# EAGLE design Ecu (1) (EAGLE 9.1.3)
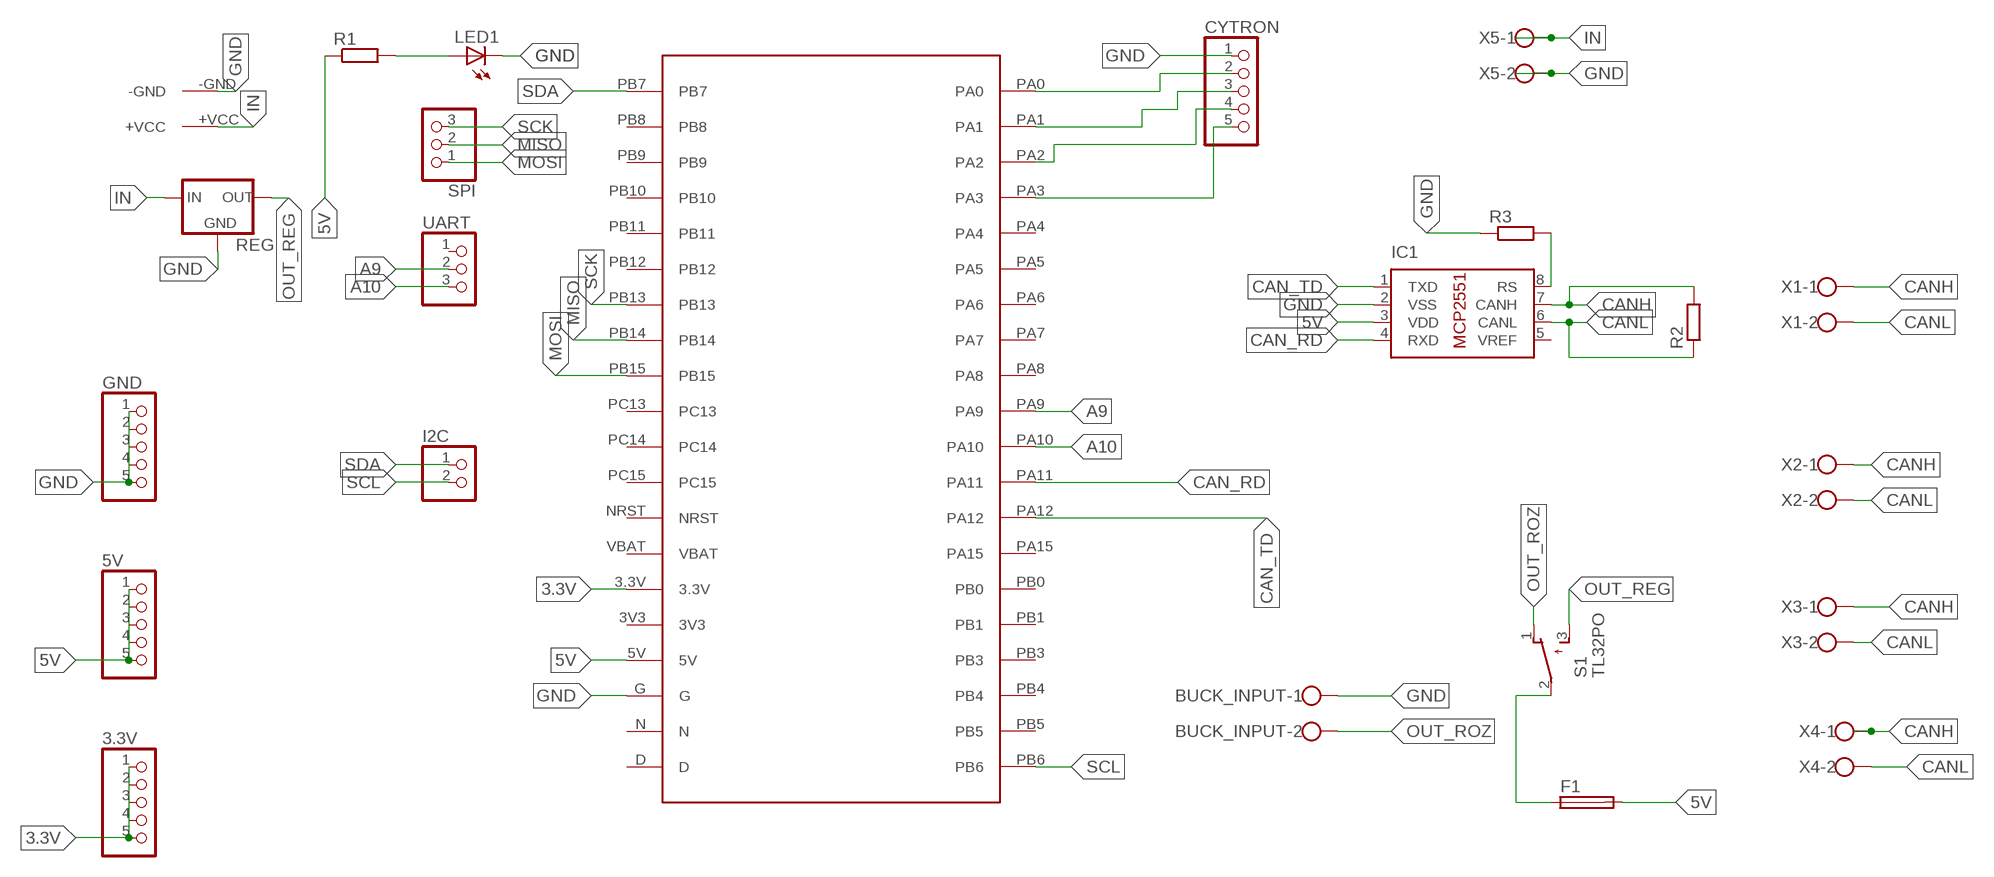
[diagram p0: schematic, sheet 1]

## Parts
3.3V  PINHD-1X5  [1X05]
5V  PINHD-1X5  [1X05]
BUCK_INPUT  W237-102  [W237-102]
CYTRON  PINHD-1X5  [1X05]
F1  GSH15  [GSH15]
GND  PINHD-1X5  [1X05]
I2C  PINHD-1X2  [1X02]
IC1  MCP2551/P  [DIL08]
LED1  LED5MM  [LED5MM]
MM1  XT60  [XT60]
R1  R-EU_0207/10  [0207/10]
R2  R-EU_0207/10  [0207/10]
R3  R-EU_0207/10  [0207/10]
REG  78XXS  [78XXS]
S1  TL32PO  [TL3XPO]
SPI  PINHD-1X3  [1X03]
U$3  STM32F103C8  [DIP]
UART  PINHD-1X3  [1X03]
X1  W237-102  [W237-102]
X2  W237-102  [W237-102]
X3  W237-102  [W237-102]
X4  W237-102  [W237-102]
X5  W237-102  [W237-102]

## Nets
3.3V: 3.3V.1 3.3V.5 U$3.3.3V
5V: 5V.1 5V.5 F1.2 IC1.3(VDD) R1.1 U$3.5V
A9: U$3.PA9 UART.2
A10: U$3.PA10 UART.3
CAN_RD: IC1.4(RXD) U$3.PA11
CAN_TD: IC1.1(TXD) U$3.PA12
CANH: IC1.7(CANH) R2.2 X1.1 X2.1 X3.1 X4.1
CANL: IC1.6(CANL) R2.1 X1.2 X2.2 X3.2 X4.2
GND: BUCK_INPUT.1 CYTRON.1 GND.1 GND.5 IC1.2(VSS) LED1.K(C) MM1.-GND R3.1 REG.GND U$3.G X5.2
IN: MM1.+VCC REG.IN X5.1
MISO: SPI.2 U$3.PB14
MOSI: SPI.1 U$3.PB15
N$1: LED1.A R1.2
N$3: CYTRON.2 U$3.PA0
N$4: CYTRON.4 U$3.PA2
N$5: CYTRON.3 U$3.PA1
N$6: CYTRON.5 U$3.PA3
N$8: IC1.8(RS) R3.2
N$9: F1.1 S1.2(P)
OUT_REG: REG.OUT S1.3(S)
OUT_ROZ: BUCK_INPUT.2 S1.1(O)
SCK: SPI.3 U$3.PB13
SCL: I2C.2 U$3.PB6
SDA: I2C.1 U$3.PB7
Unconnected: 3.3V.2 3.3V.3 3.3V.4 5V.2 5V.3 5V.4 GND.2 GND.3 GND.4 IC1.5(VREF) U$3.3V3 U$3.D U$3.N U$3.NRST U$3.PA4 U$3.PA5 U$3.PA6 U$3.PA7 U$3.PA8 U$3.PA15 U$3.PB0 U$3.PB1 U$3.PB3 U$3.PB4 U$3.PB5 U$3.PB8 U$3.PB9 U$3.PB10 U$3.PB11 U$3.PB12 U$3.PC13 U$3.PC14 U$3.PC15 U$3.VBAT UART.1

## Library data of the parts
3.3V 5V CYTRON GND = pinhead:PINHD-1X5: PIN HEADER
BUCK_INPUT X1-X5 = con-wago-500:W237-102: WAGO SCREW CLAMP; MPN: 237-102; OC_FARNELL: unknown; OC_NEWARK: 70K9898
F1 = fuse:GSH15: FUSE HOLDER grid 15mm, 19649 Wickmann; MPN: 64900001039; OC_FARNELL: 1271673; OC_NEWARK: 02P0318
I2C = pinhead:PINHD-1X2: PIN HEADER
IC1 = microchip-dspic:MCP2551: High-Speed CAN Transceiver
LED1 = led:LED: LED OSRAM: - CHIPLED LG R971, LG N971, LY N971, LG Q971, LY Q971, LO R971, LY R971 LH N974, LH R974 LS Q976, LO Q976, LY Q976 LO Q996 - Hyper CHIPLED LW Q18S LB Q993, LB Q99A, LB R99A - SideLED LS A670, LO A670, LY A670, LG A670, LP A670 LB A673, LV A673, LT A673, LW A673 LH A674 LY A675 LS A676, LA A676, LO A676, LY A676, LW A676 LS A679, LY A679, LG A679 - Hyper Micro SIDELED® LS Y876, LA Y876, LO Y876, LY Y876 LT Y87S - SmartLED LW L88C, LW L88S LB L89C, LB L89S, LG L890 LS L89K, LO L89K, LY L89K LS L896, LA L896, LO L896, LY L896 - TOPLED LS T670, LO T670, LY T670, LG T670, LP T670 LSG T670, LSP T670, LSY T670, LOP T670, LYG T670 LG T671, LOG T671, LSG T671 LB T673, LV T673, LT T673, LW T673 LH T674 LS T676, LA T676, LO T676, LY T676, LB T676, LH T676, LSB T676, LW T676 LB T67C, LV T67C, LT T67C, LS T67K, LO T67K, LY T67K, LW E67C LS E67B, LA E67B, LO E67B, LY E67B, LB E67C, LV E67C, LT E67C LW T67C LS T679, LY T679, LG T679 LS T770, LO T770, LY T770, LG T770, LP T770 LB T773, LV T773, LT T773, LW T773 LH T774 LS E675, LA E675, LY E675, LS T675 LS T776, LA T776, LO T776, LY T776, LB T776 LHGB T686 LT T68C, LB T68C - Hyper Mini TOPLED® LB M676 - Mini TOPLED Santana® LG M470 LS M47K, LO M47K, LY M47K Source: http://www.osram.convergy.de LUXEON: - LUMILED® LXK2-PW12-R00, LXK2-PW12-S00, LXK2-PW14-U00, LXK2-PW14-V00 LXK2-PM12-R00, LXK2-PM12-S00, LXK2-PM14-U00 LXK2-PE12-Q00, LXK2-PE12-R00, LXK2-PE12-S00, LXK2-PE14-T00, LXK2-PE14-U00 LXK2-PB12-K00, LXK2-PB12-L00, LXK2-PB12-M00, LXK2-PB14-N00, LXK2-PB14-P00, LXK2-PB14-Q00 LXK2-PR12-L00, LXK2-PR12-M00, LXK2-PR14-Q00, LXK2-PR14-R00 LXK2-PD12-Q00, LXK2-PD12-R00, LXK2-PD12-S00 LXK2-PH12-R00, LXK2-PH12-S00 LXK2-PL12-P00, LXK2-PL12-Q00, LXK2-PL12-R00 Source: www.luxeon.com KINGBRIGHT: KA-3528ASYC Source: www.kingbright.com
MM1 = torpedo:XT60
R1-R3 = rcl:R-EU_: RESISTOR, European symbol
REG = v-reg:78XXS: VOLTAGE REGULATOR
S1 = switch:TL32PO: TINY SWITCH ON - MOM Source: http://www2.produktinfo.conrad.com/datenblaetter/700000-724999/705152-da-01-de-Subminiaturschalter_TL_36YO.pdf
SPI UART = pinhead:PINHD-1X3: PIN HEADER
U$3 = stm_developer_board:STM32F103C8: STM32F103C8 Block

## Board
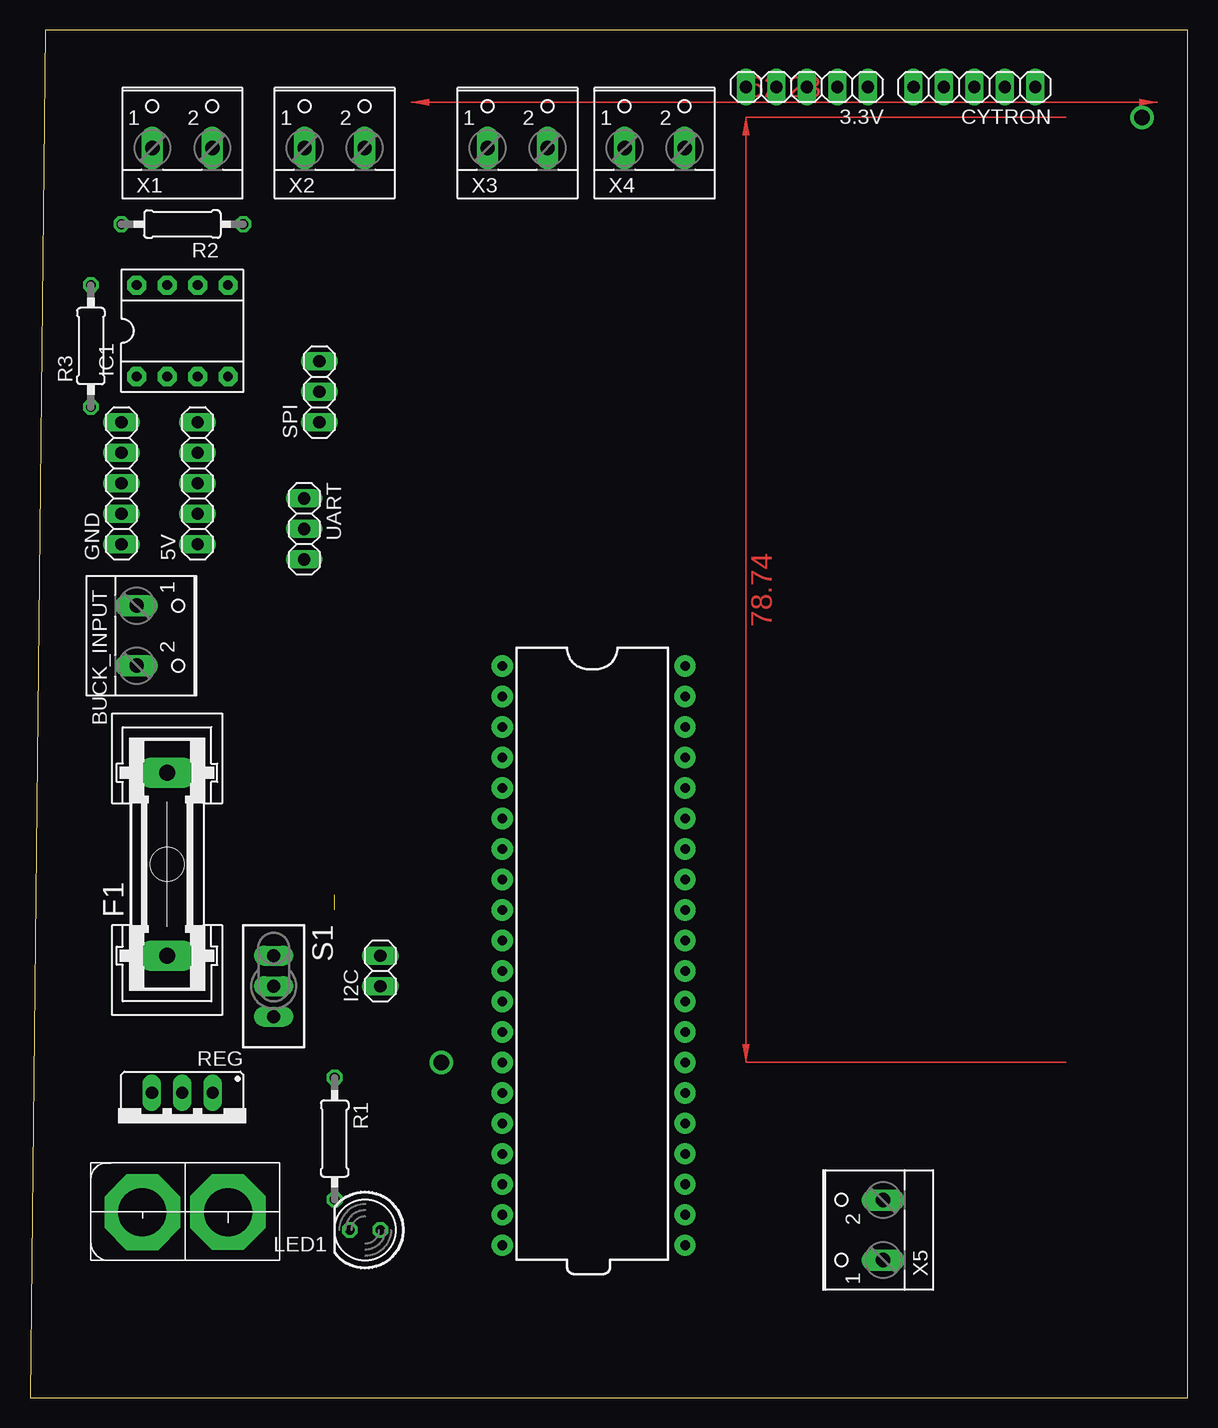
[diagram p1: board, top side]
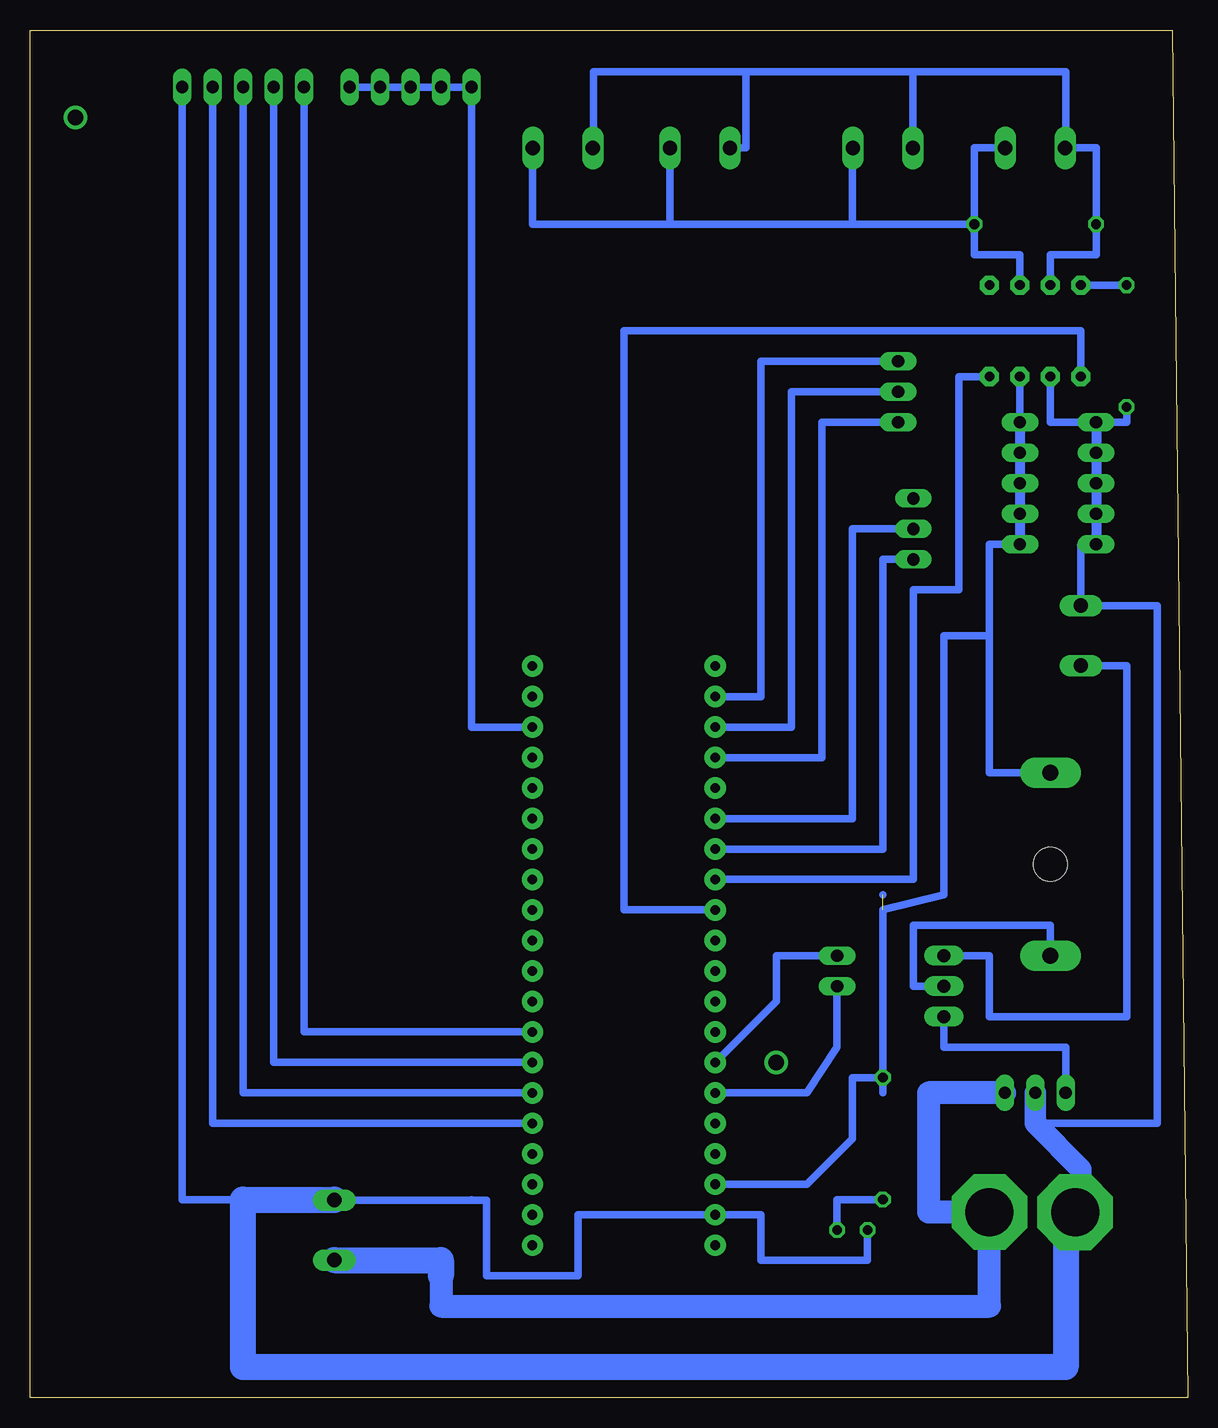
[diagram p2: board, bottom side, seen from below]

Size 96.5 x 113.97 mm. Coordinates in mm from the lower left corner, seen from the top.
Outline: 0,0 96.5,0 96.5,113.97 1.27,113.97 0,0
Copper layers (1*16): Top 0.035mm / dielectric 1.5mm / Bottom 0.035mm
Design rules "default": minimum track width 10mil, minimum drill 24mil, track to track 8mil, track to pad 8mil, pad to pad 8mil, via to via 8mil, smd to smd 8mil, copper to edge 40mil, drill to drill 8mil, minimum pad ring 10mil, minimum via ring 8mil, stop-mask expansion 4mil, vias tented up to drill 0mil, thermal gap 10mil

### Footprints (pad centres in the part's own frame; a part is rotated, then mirrored left to right if it is on the bottom)
1X05 = drill 1.016 long: 1 -5.08,0; 2 -2.54,0; 3 0,0; 4 2.54,0; 5 5.08,0
W237-102 = drill 1.194 long: 1 -2.5,-1.27; 2 2.5,-1.27
GSH15 = drill 1.321 pad 2.54 long: 1 -7.62,0; 2 7.62,0 | hole 2.794: 0,0
1X02 = drill 1.016 long: 1 -1.27,0; 2 1.27,0
DIL08 = drill 0.813 pad 1.6 octagon: 1 -3.81,-3.81; 2 -1.27,-3.81; 3 1.27,-3.81; 4 3.81,-3.81; 5 3.81,3.81; 6 1.27,3.81; 7 -1.27,3.81; 8 -3.81,3.81
LED5MM = drill 0.813 octagon: A -1.27,0; K 1.27,0
XT60 = drill 4 pad 6.3 octagon: +VCC 11.43,4.04; -GND 4.29,4.02
0207/10 = drill 0.813 octagon: 1 -5.08,0; 2 5.08,0
78XXS = drill 1.016 long: GND 0,-2.54; IN -2.54,-2.54; OUT 2.54,-2.54
TL3XPO = drill 1.1 pad 1.422 long: 1 -2.54,0; 2 0,0; 3 2.54,0
1X03 = drill 1.016 long: 1 -2.54,0; 2 0,0; 3 2.54,0
DIP = drill 0.8 pad 1.778: 3.3V 15.24,43.18; 3V3 0,0; 5V 0,5.08; D 15.24,45.72; G 0,2.54; N 15.24,48.26; NRST 15.24,40.64; PA0 15.24,10.16; PA1 15.24,12.7; PA2 15.24,15.24; PA3 15.24,17.78; PA4 15.24,20.32; PA5 15.24,22.86; PA6 15.24,25.4; PA7 15.24,27.94; PA8 0,38.1; PA9 0,35.56; PA10 0,33.02; PA11 0,30.48; PA12 0,27.94; PA15 0,25.4; PB0 15.24,30.48; PB1 15.24,33.02; PB3 0,22.86; PB4 0,20.32; PB5 0,17.78; PB6 0,15.24; PB7 0,12.7; PB8 0,10.16; PB9 0,7.62; PB10 15.24,35.56; PB11 15.24,38.1; PB12 0,48.26; PB13 0,45.72; PB14 0,43.18; PB15 0,40.64; PC13 15.24,2.54; PC14 15.24,5.08; PC15 15.24,7.62; VBAT 15.24,0

### Placement (x,y rotation side)
3.3V  64.77,109.22 180 top
5V  13.97,76.2 90 top
BUCK_INPUT  10.16,63.5 270 top
CYTRON  78.74,109.22 180 top
F1  11.43,44.45 90 top
GND  7.62,76.2 90 top
I2C  29.21,35.56 90 top
IC1  12.7,88.9 0 top
LED1  27.94,13.97 180 top
MM1  5.08,11.43 0 top
R1  25.4,21.59 270 top
R2  12.7,97.79 180 top
R3  5.08,87.63 90 top
REG  12.7,22.86 180 top
S1  20.32,34.29 270 top
SPI  24.13,83.82 90 top
U$3  39.37,12.7 0 top
UART  22.86,72.39 270 top
X1  12.7,105.41 0 top
X2  25.4,105.41 0 top
X3  40.64,105.41 0 top
X4  52.07,105.41 0 top
X5  69.85,13.97 90 top

### Tracks (layer width: path | path; a pad name or v marks a point on that pad's centre or on a via)
3.3V
  Bottom 0.61: 3.3V.1 3.3V.5 59.69,55.88 U$3.3.3V
5V  (1 unrouted)
  Bottom 0.61: IC1.3 5V.5 | 16.51,63.5 20.32,63.5 20.32,41.91 23.01,41.24 25.4,40.64 R1.1 | U$3.5V 31.75,17.78 27.94,21.59 27.94,26.67 R1.1 | R1.1 25.4,25.4 | F1.2 16.51,52.07 16.51,63.5 | 16.51,63.5 16.51,71.12 5V.1 | 25.4,41.91
  Bottom 0.813: 5V.5 5V.1
A9
  Bottom 0.61: UART.2 27.94,72.39 27.94,48.26 U$3.PA9
A10
  Bottom 0.61: UART.3 25.4,69.85 25.4,45.72 U$3.PA10
CAN_RD
  Bottom 0.61: U$3.PA11 22.86,43.18 22.86,67.31 19.05,67.31 19.05,85.09 IC1.4
CAN_TD
  Bottom 0.61: IC1.1 8.89,88.9 46.99,88.9 46.99,40.64 U$3.PA12
CANH
  Bottom 0.61: IC1.7 11.43,95.25 7.62,95.25 R2.2 7.62,104.14 X1.1 10.16,104.14 10.16,110.49 22.9,110.49 | 22.9,110.49 X2.1 | X3.1 36.83,104.14 36.83,110.49 | 36.83,110.49 22.9,110.49 | X4.1 49.53,104.14 49.53,110.49 36.83,110.49
CANL
  Bottom 0.61: IC1.6 13.97,95.25 17.78,95.25 R2.1 | R2.1 17.78,104.14 X1.2 | X4.2 54.61,104.14 54.61,97.79 43.14,97.79 | 43.14,97.79 X3.2 | X2.2 27.94,104.14 27.94,97.79 | 27.94,97.79 43.14,97.79 | R2.1 27.94,97.79
GND
  Bottom 0.61: IC1.2 11.43,81.28 GND.5 5.08,81.28 R3.1 | GND.1 8.89,71.08 BUCK_INPUT.1 2.54,66 2.54,22.86 12.7,22.86 | LED1.K 26.67,11.43 35.56,11.43 35.56,15.24 U$3.G 50.8,15.24 50.8,10.16 58.42,10.16 58.42,16.47 59.69,16.47 | MM1.-GND 10.16,15.45 | X5.2 59.69,16.47 | 59.69,16.47 59.69,16.51 | 78.74,16.51 83.82,16.51 CYTRON.1
  Bottom 0.813: GND.5 GND.1
  Bottom 1.778: REG.GND 12.7,22.86 8.89,19.05 8.89,15.93 MM1.-GND
  Bottom 2.184: 10.16,15.45 10.16,2.54 78.74,2.54 78.74,16.51 71.12,16.51 X5.2
IN
  Bottom 1.93: REG.IN 21.59,25.4 21.59,15.47 MM1.+VCC 16.51,7.62 62.23,7.62 62.23,10.16 62.23,11.41
  Bottom 2.184: X5.1 62.23,11.47 62.23,10.16
MISO
  Bottom 0.61: SPI.2 33.02,83.82 33.02,55.88 U$3.PB14
MOSI
  Bottom 0.61: SPI.1 30.48,81.28 30.48,53.34 U$3.PB15
N$1
  Bottom 0.61: R1.2 29.21,16.51 LED1.A
N$2  (via drill 1.3)
  other vias: 34.29,27.94
N$3
  Bottom 0.61: U$3.PA0 81.28,22.86 CYTRON.2
N$4
  Bottom 0.61: U$3.PA2 76.2,27.94 CYTRON.4
N$5
  Bottom 0.61: U$3.PA1 78.74,25.4 CYTRON.3
N$6
  Bottom 0.61: U$3.PA3 73.66,30.48 CYTRON.5
N$7  (via drill 1.3)
  other vias: 92.71,106.68
N$8
  Bottom 0.61: R3.2 IC1.8
N$9
  Bottom 0.61: F1.1 11.43,39.37 22.86,39.37 22.86,34.29 S1.2
OUT_REG
  Bottom 0.61: S1.3 20.32,29.21 10.16,29.21 REG.OUT
OUT_ROZ
  Bottom 0.61: BUCK_INPUT.2 5.08,61 5.08,31.75 16.51,31.75 16.51,36.83 S1.1
SCK
  Bottom 0.61: SPI.3 35.56,86.36 35.56,58.42 U$3.PB13
SCL
  Bottom 0.61: U$3.PB6 34.29,33.02 34.29,36.83 I2C.2
SDA
  Bottom 0.61: U$3.PB7 31.75,25.4 29.21,29.21 I2C.1
(copper drawn outside any net)
  shapes: Top area x2